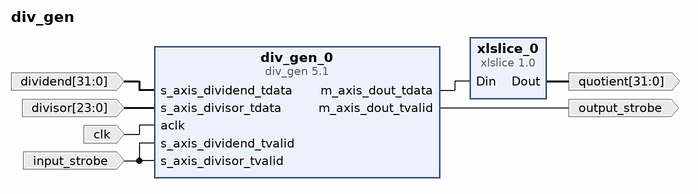
[diagram p0: block diagram of the top level]
# Vivado block design div_gen, xczu9eg-ffvb1156-2-e, Vivado 2018.3
create_bd_design div_gen

create_bd_port -dir O -from 31 -to 0 -type data quotient
create_bd_port -dir I -from 31 -to 0 -type data dividend
create_bd_port -dir I -from 23 -to 0 -type data divisor
create_bd_port -dir I -type clk clk
set_property -dict {CONFIG.FREQ_HZ 200000000} [get_bd_ports clk]
create_bd_port -dir I input_strobe
create_bd_port -dir O output_strobe

create_bd_cell -type ip -vlnv xilinx.com:ip:div_gen:5.1 div_gen_0
set_property -dict [list \
  CONFIG.dividend_and_quotient_width 32 \
  CONFIG.divisor_width 24 \
  CONFIG.fractional_width 24 \
  CONFIG.latency 60 \
  CONFIG.remainder_type Fractional \
] [get_bd_cells div_gen_0]
create_bd_cell -type ip -vlnv xilinx.com:ip:xlslice:1.0 xlslice_0
set_property -dict {CONFIG.DIN_FROM 55 CONFIG.DIN_TO 24 CONFIG.DIN_WIDTH 56 CONFIG.DOUT_WIDTH 1} [get_bd_cells xlslice_0]

# ---- connections ----

connect_bd_net [get_bd_pins xlslice_0/Dout] [get_bd_ports quotient]
connect_bd_net [get_bd_pins div_gen_0/m_axis_dout_tdata] [get_bd_pins xlslice_0/Din]
connect_bd_net [get_bd_ports dividend] [get_bd_pins div_gen_0/s_axis_dividend_tdata]
connect_bd_net [get_bd_ports divisor] [get_bd_pins div_gen_0/s_axis_divisor_tdata]
connect_bd_net [get_bd_ports clk] [get_bd_pins div_gen_0/aclk]
connect_bd_net [get_bd_ports input_strobe] [get_bd_pins div_gen_0/s_axis_divisor_tvalid] [get_bd_pins div_gen_0/s_axis_dividend_tvalid]
connect_bd_net [get_bd_pins div_gen_0/m_axis_dout_tvalid] [get_bd_ports output_strobe]

validate_bd_design
save_bd_design
